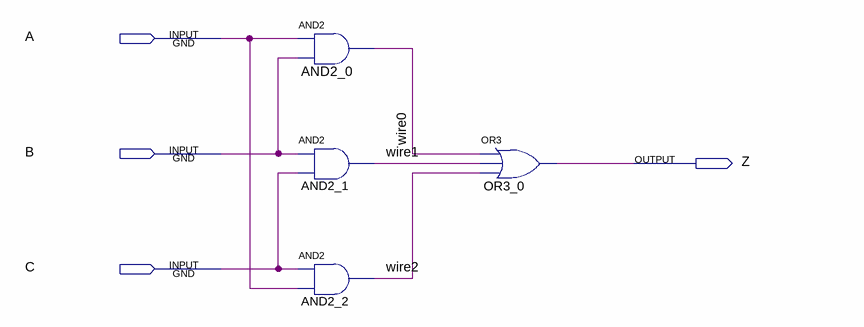
[diagram p0: schematic sheet]
// Quartus schematic majority_voter0.bdf as structural Verilog: 4 symbols, 4 pins
module majority_voter0 (
  input  A,
  input  B,
  input  C,
  output Z
);

  wire wire0, wire1, wire2;

  and AND2_0 (wire0, A, B);
  and AND2_1 (wire1, B, C);
  and AND2_2 (wire2, C, A);
  or OR3_0 (Z, wire0, wire1, wire2);
endmodule
